# EasyEDA Pro project ProPrj_Arduino_Contest_2025_2025-11-19.epro, board Sensor_Module_Rev_0
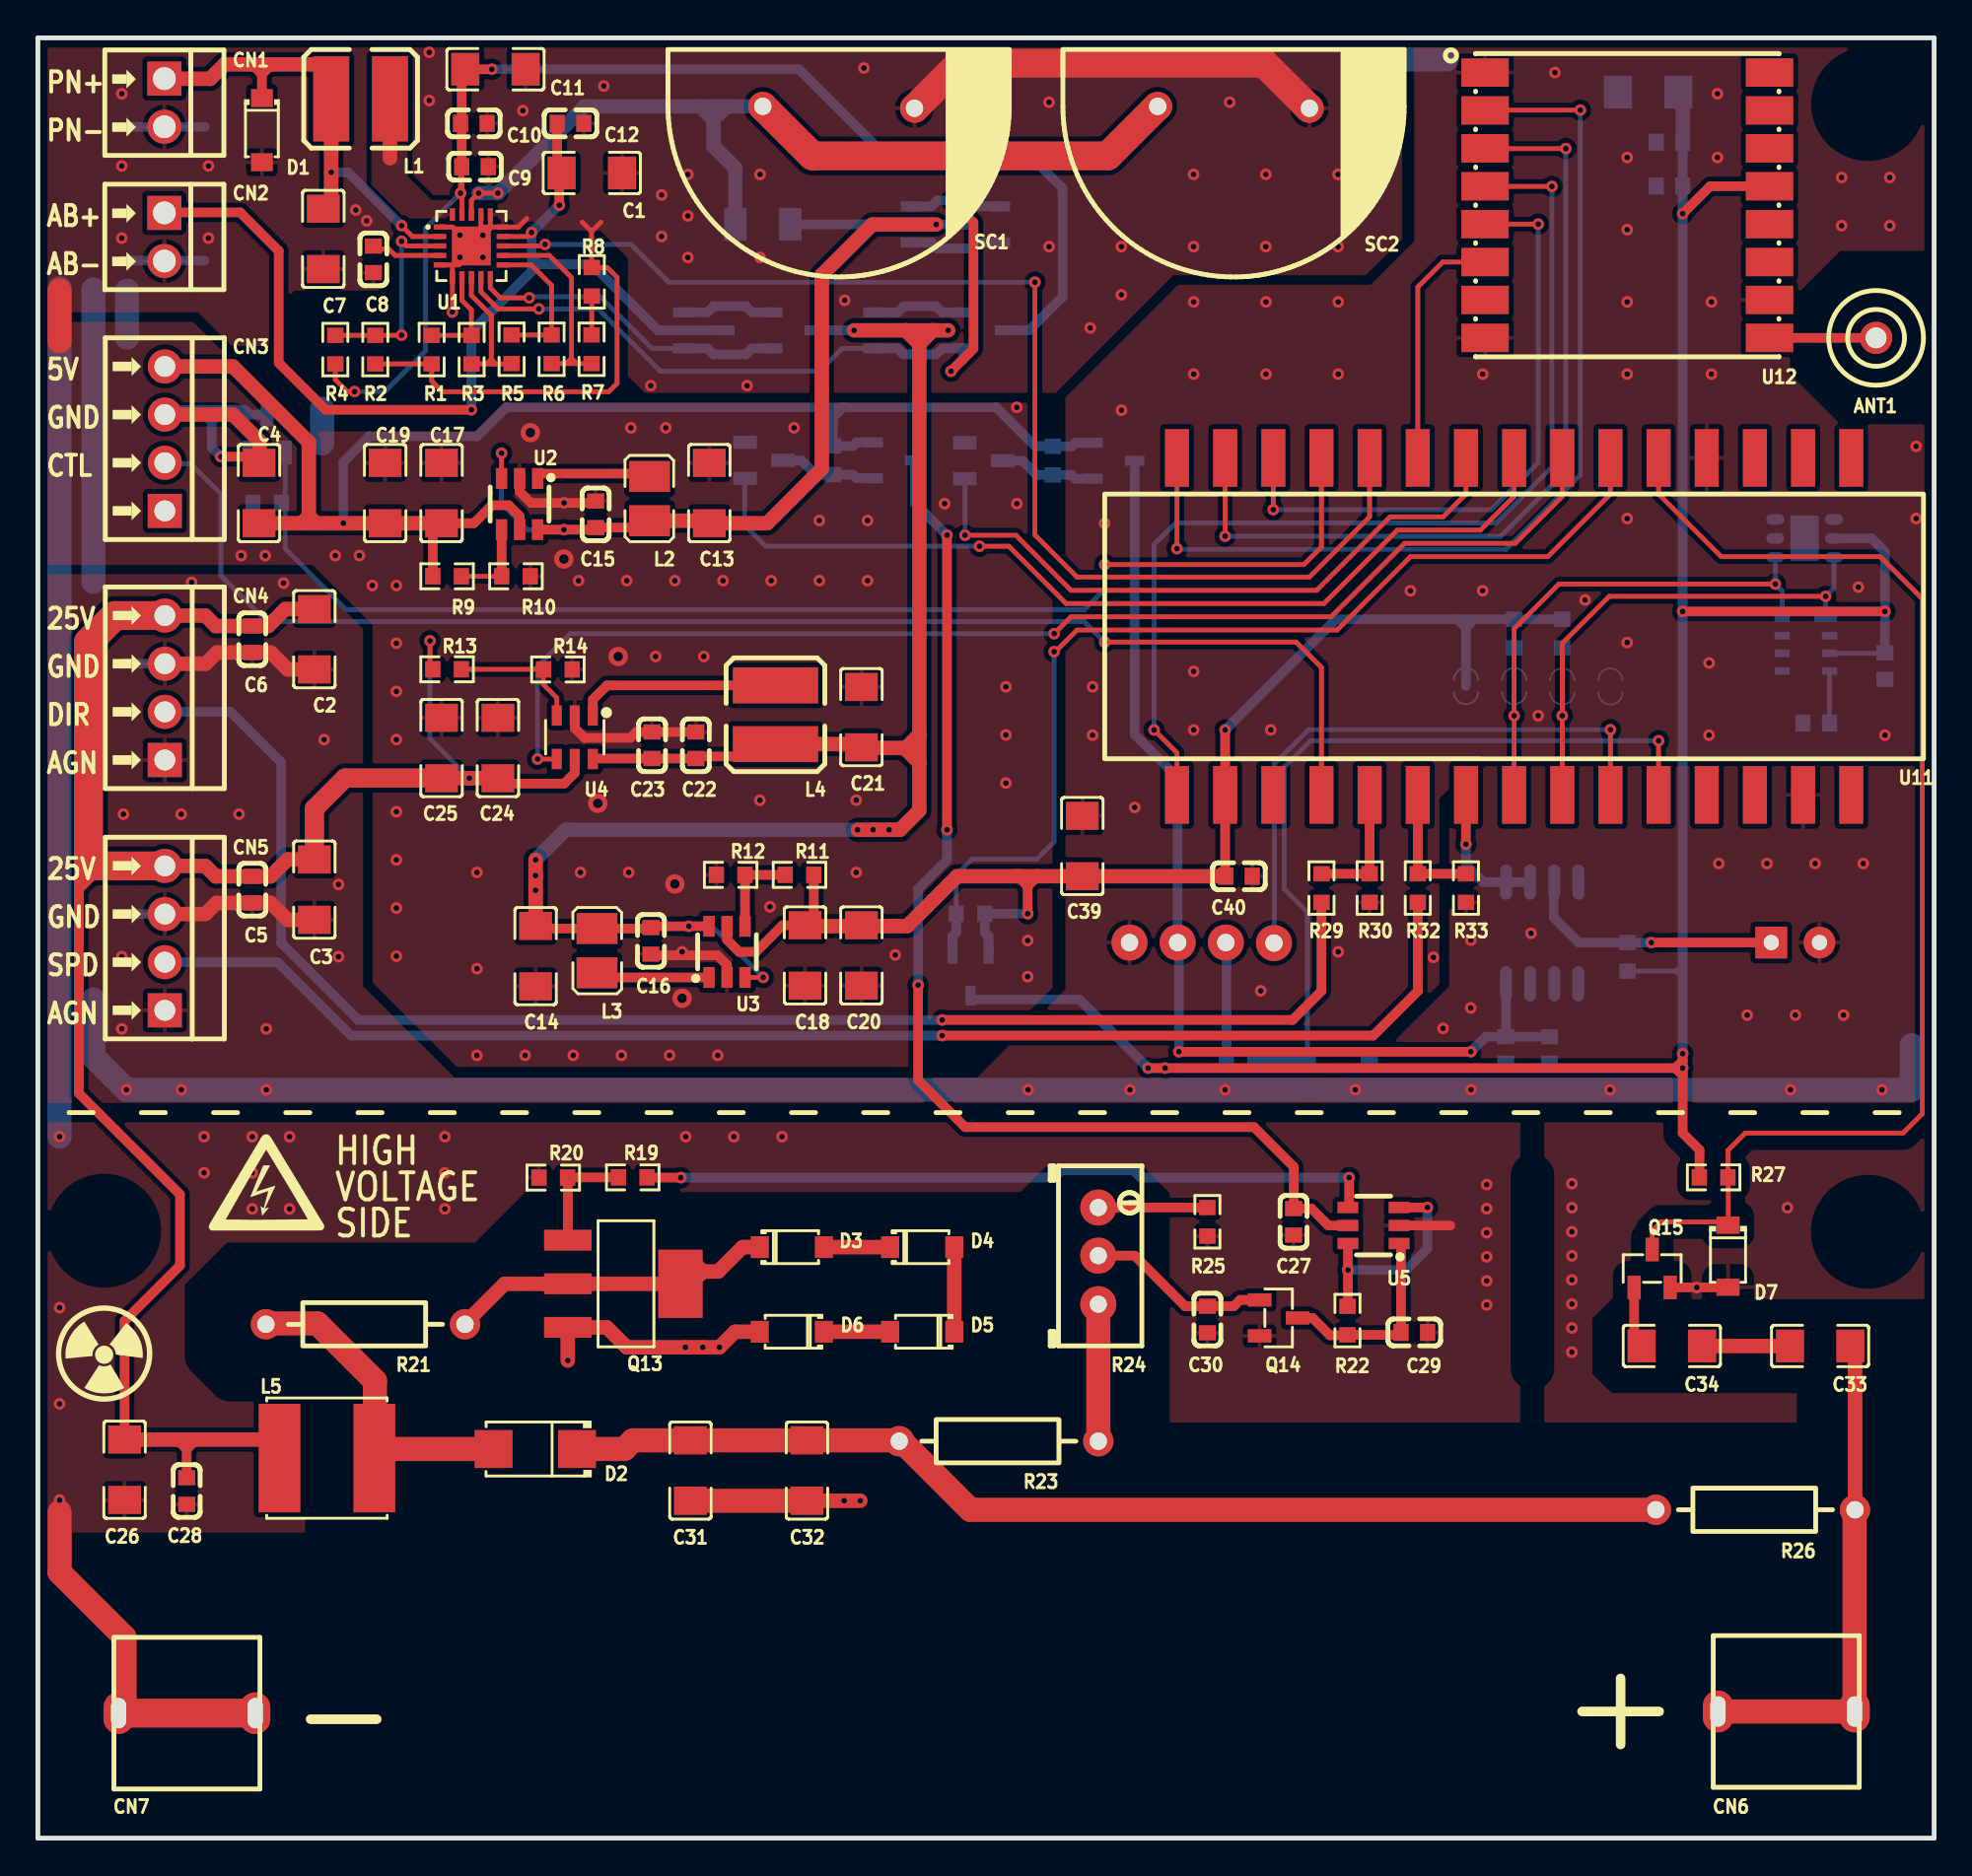
[diagram p23: board, top side]
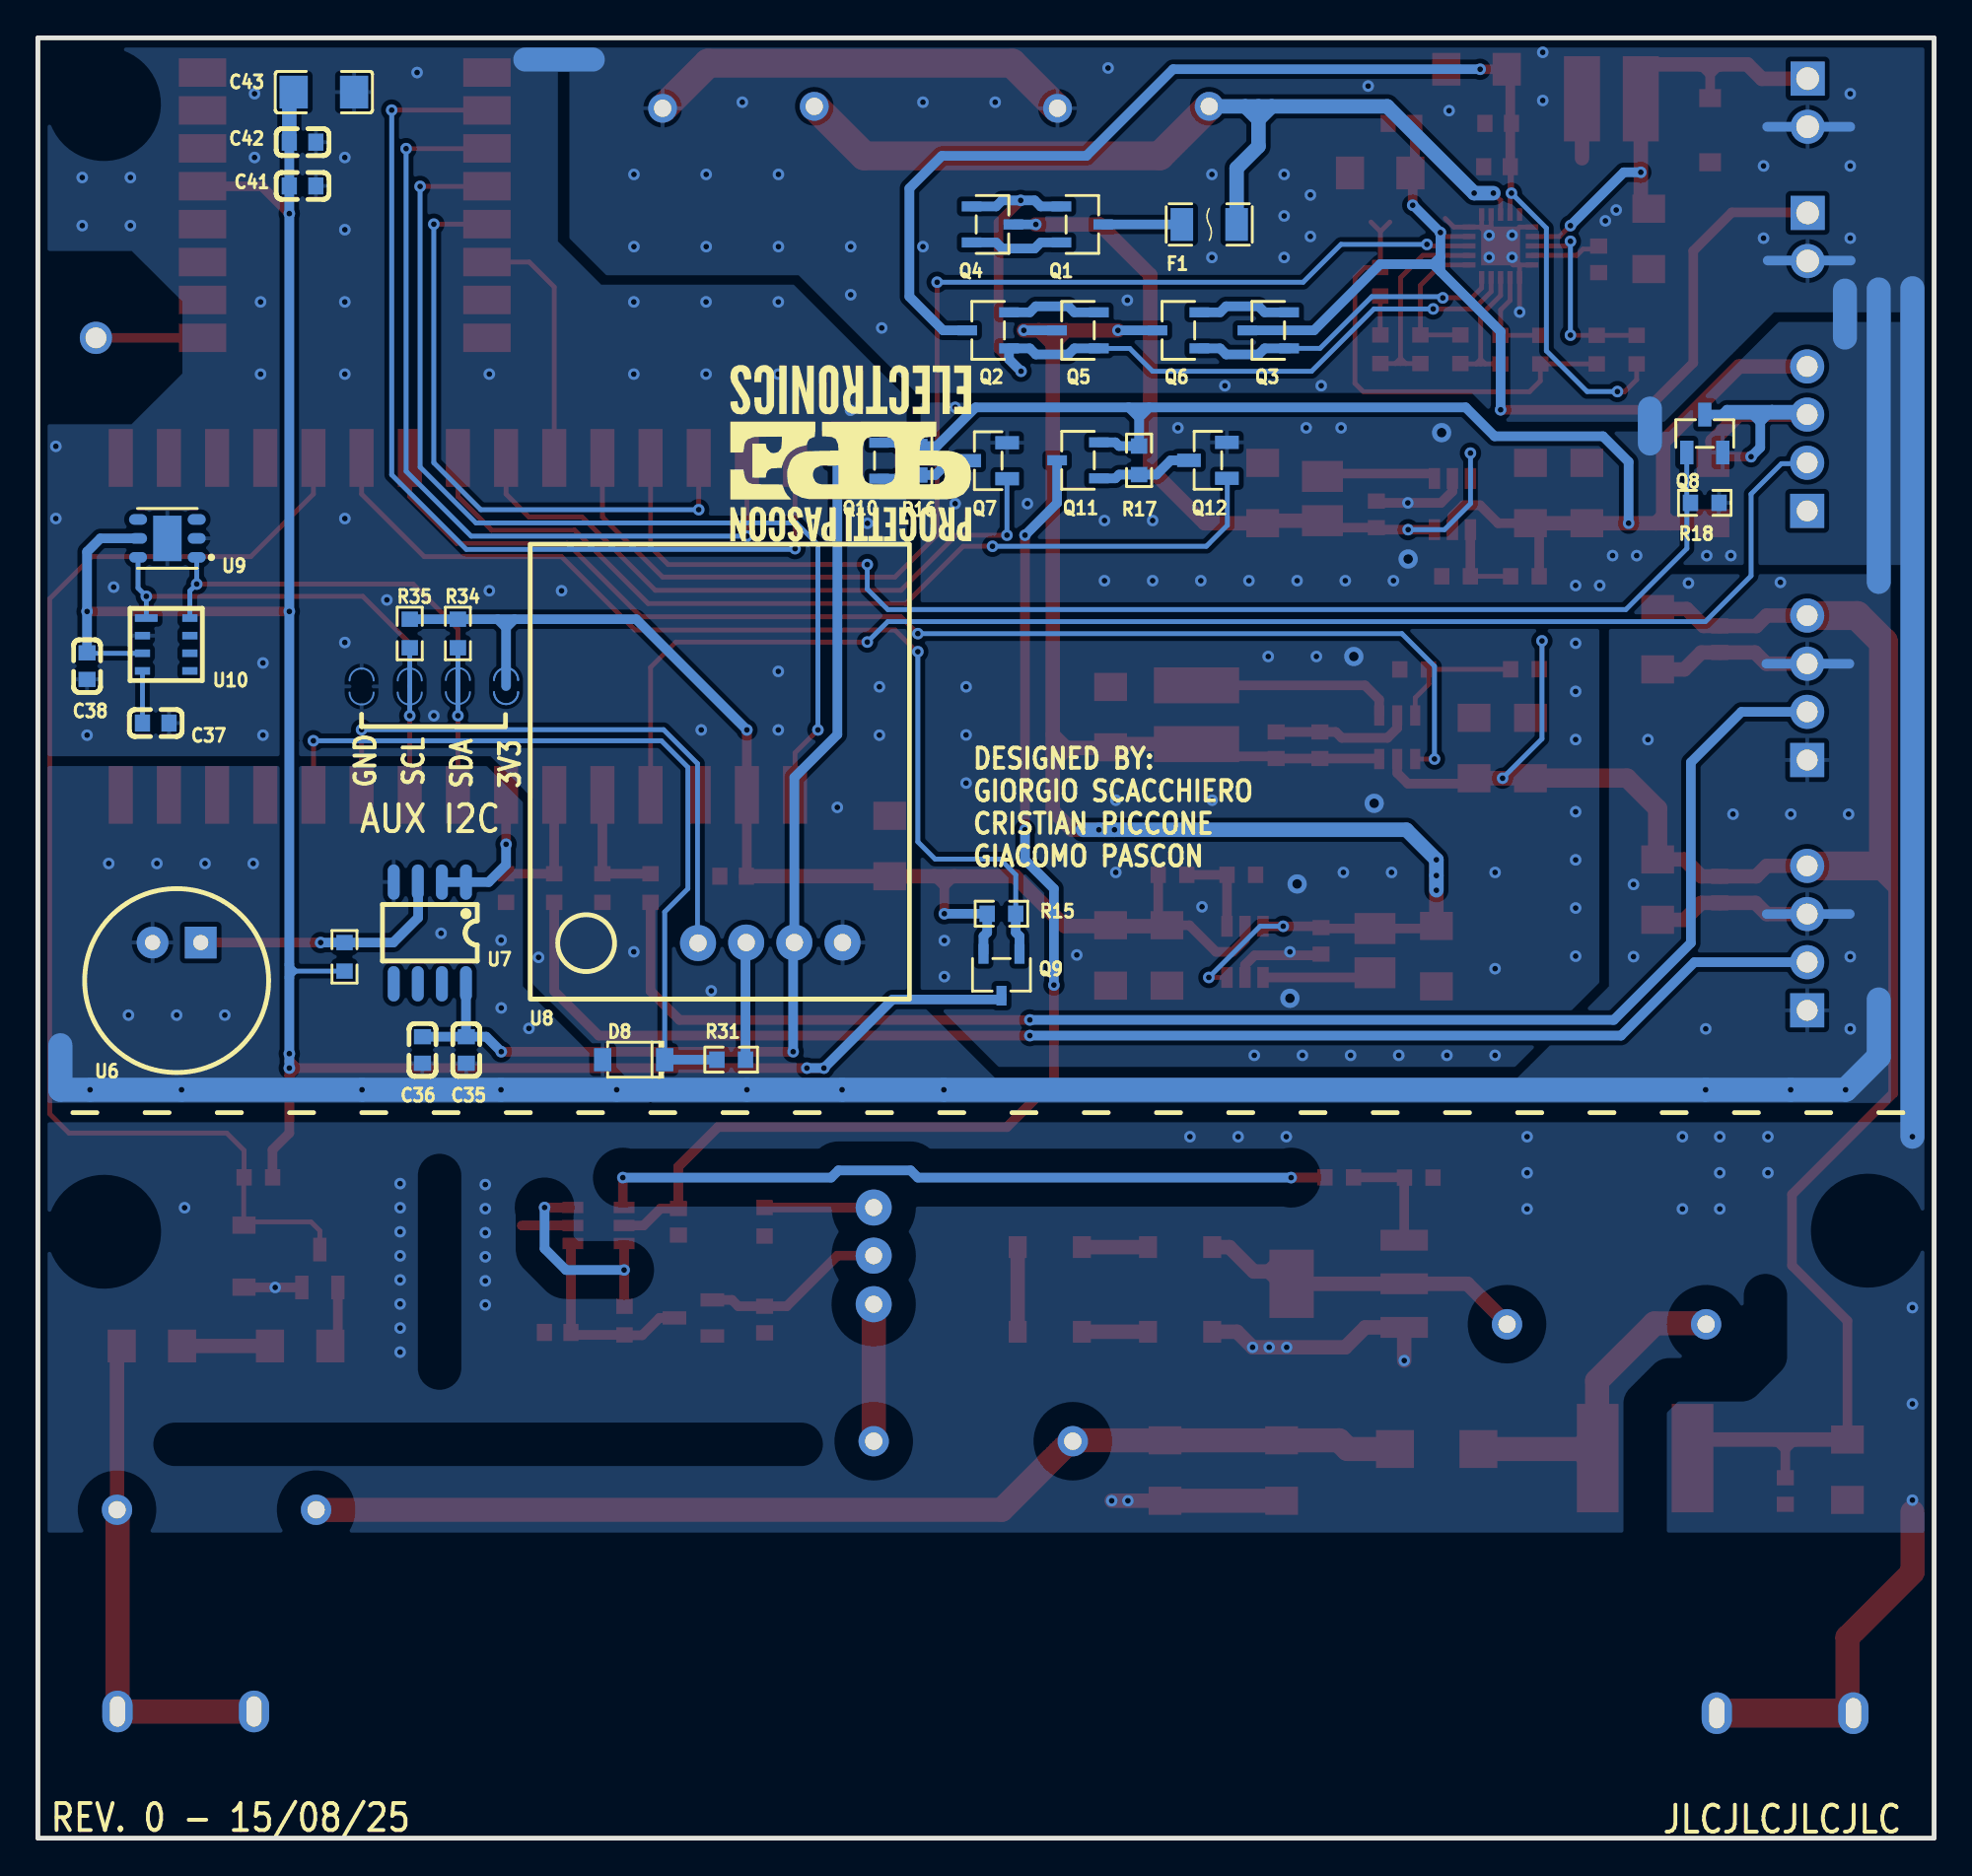
[diagram p24: board, bottom side, seen from below]

Outline 100 x 94.98 mm; copper layers: Top Layer, Bottom Layer. Coordinates in mm from the lower left corner of the outline.
Outline path: 0,94.98 100,94.98 100,0 0,0 0,94.98
Stack: Top Layer 0.035mm / Dielectric1 1.51mm FR4 er 4.5 / Bottom Layer 0.035mm

## Design rules (mm)
template: Custom Config
spacing copperThickness1oz (default): track to track 0.152, other pairs 0.152 to 0.3
spacing copperThickness2oz: track to track 0.203, other pairs 0.152 to 0.3
track width copperThickness1oz (default): min 0.127, default 0.254, max 2.54
track width copperThickness2oz: min 0.203, default 0.254, max 2.54
differential pair differentialPair (default): width min 0.127, default 0.254, max 2.54; gap min 0.152, default 0.152
via viaSize (default): diameter min 0.305, default 0.61, max 10.16; hole min 0.152, default 0.305, max 9.779
net $2N7577 uses traceRegion
pour e1770 uses Geiger_Logic_Copper
pour e2021 uses Geiger_Power_Copper

## Placement (name value [footprint] x y rotation side)
ANT1  VG868SNX18-5W2  [ANT-TH_VG868SNX18-5W2]  96.94 79.16 0 top
C1  4.7uF  [C1206]  29.21 87.86 180 top
C2  4.7uF  [C1206]  14.58 63.26 90 top
C3  4.7uF  [C1206]  14.58 50.04 90 top
C4  4.7uF  [C1206]  11.66 70.97 270 top
C5  100nF  [C0603]  11.3 50.04 90 top
C6  100nF  [C0603]  11.3 63.26 90 top
C7  4.7uF  [C1206]  15.05 84.38 90 top
C8  100pF  [C0603]  17.69 83.3 270 top
C9  100pF  [C0603]  23.05 88.19 180 top
C10  100nF  [C0603]  22.99 90.47 180 top
C11  4.7uF  [C1206]  24.13 93.33 180 top
C12  100pF  [C0603]  28.09 90.47 0 top
C13  4.7uF  [C1206]  35.41 70.97 270 top
C14  4.7uF  [C1206]  26.25 46.53 90 top
C15  100nF  [C0603]  29.41 69.85 270 top
C16  100nF  [C0603]  32.33 47.34 90 top
C17  4.7uF  [C1206]  21.29 70.97 270 top
C18  4.7uF  [C1206]  40.46 46.57 90 top
C19  4.7uF  [C1206]  18.31 70.97 270 top
C20  4.7uF  [C1206]  43.43 46.57 90 top
C21  4.7uF  [C1206]  43.43 59.14 270 top
C22  100nF  [C0603]  34.7 57.66 270 top
C23  100pF  [C0603]  32.39 57.66 270 top
C24  4.7uF  [C1206]  24.26 57.51 270 top
C25  4.7uF  [C1206]  21.29 57.51 270 top
C26  4.7uF  [C1206]  4.57 19.44 90 top
C27  100nF  [C0603]  66.22 32.52 90 top
C28  100nF  [C0603]  7.84 18.31 90 top
C29  10pF  [C0603]  72.59 26.68 180 top
C30  100pF  [C0603]  61.68 27.36 90 top
C31  1nF  [C1206]  34.41 19.39 90 top
C32  1nF  [C1206]  40.56 19.39 90 top
C33  10pF  [C1206]  93.99 25.97 0 top
C34  10pF  [C1206]  86.17 25.97 0 top
C35  100pF  [C0603]  77.41 41.58 90 bottom
C36  100nF  [C0603]  79.72 41.58 90 bottom
C37  100nF  [C0603]  93.79 58.83 0 bottom
C38  100nF  [C0603]  97.41 61.84 90 bottom
C39  4.7uF  [C1206]  55.08 52.34 90 top
C40  100nF  [C0603]  63.34 50.75 0 top
C41  100pF  [C0603]  86.04 87.17 0 bottom
C42  100nF  [C0603]  86.04 89.48 0 bottom
C43  4.7uF  [C1206]  84.92 92.12 0 bottom
CN1  DB125-2.54-2P-GN-S  [CONN-TH_DB125-2.54-2P-GN]  6.67 91.56 270 top
CN2  DB125-2.54-2P-GN-S  [CONN-TH_DB125-2.54-2P-GN]  6.67 84.48 270 top
CN3  DB125-2.54-4P-GN-S  [CONN-TH_DB125-2.54-4P-GN]  6.69 73.84 90 top
CN4  DB125-2.54-4P-GN-S  [CONN-TH_DB125-2.54-4P-GN]  6.69 60.69 90 top
CN5  DB125-2.54-4P-GN-S  [CONN-TH_DB125-2.54-4P-GN]  6.69 47.49 90 top
CN6  XF-007  [FUSE-TH_XF-007]  92.2 6.68 180 top
CN7  XF-007  [FUSE-TH_XF-007]  7.86 6.59 0 top
D1  1N4148W  [SOD-123_L2.8-W1.8-LS3.7-RD-1]  11.81 90.12 270 top
D2  RS1M  [SMA_L4.3-W2.6-LS5.2-RD]  26.23 20.53 180 top
D3  BZD27C200P  [SOD-123_L2.8-W1.8-LS3.7-RD]  39.76 31.18 0 top
D4  BZD27C200P  [SOD-123_L2.8-W1.8-LS3.7-RD]  46.64 31.18 0 top
D5  BZD27C200P  [SOD-123_L2.8-W1.8-LS3.7-RD]  46.64 26.72 180 top
D6  BZD27C200P  [SOD-123_L2.8-W1.8-LS3.7-RD]  39.76 26.72 180 top
D7  BZT52C3V3  [SOD-123_L2.7-W1.6-LS3.7-RD]  89.13 30.7 270 top
D8  BZT52C3V3  [SOD-123_L2.7-W1.6-LS3.7-RD]  68.58 41.07 0 bottom
F1  CFS12V3T2R50  [F1206]  38.23 85.14 0 bottom
L1  22uH  [IND-SMD_L4.5-W4.0]  17.02 91.77 0 top
L2  2.2uH  [L1008]  32.26 70.68 90 top
L3  2.2uH  [L1008]  29.49 46.82 270 top
L4  22uH  [IND-SMD_L4.5-W4.0]  38.9 59.27 270 top
L5  1mH  [IND-SMD_L6.0-W6.0]  15.24 20.05 0 top
NOREF  -  [Pad_e1683]  75.31 60.78 0 top
NOREF#2  -  [Pad_e1682]  82.93 60.76 0 top
NOREF#3  -  [Pad_e1611]  77.85 60.78 0 top
NOREF#4  -  [Pad_e1610]  80.39 60.76 0 top
NOREF#5  -  [Pad_e1821]  75.31 60.78 0 top
Q1  DO2301E-Q  [SOT-23-3_L3.0-W1.7-P0.95-LS2.9-BR]  44.92 85.14 0 bottom
Q2  DO2301E-Q  [SOT-23-3_L3.0-W1.7-P0.95-LS2.9-BR]  49.89 79.55 180 bottom
Q3  DO2301E-Q  [SOT-23-3_L3.0-W1.7-P0.95-LS2.9-BR]  35.11 79.55 180 bottom
Q4  DO2301E-Q  [SOT-23-3_L3.0-W1.7-P0.95-LS2.9-BR]  49.66 85.14 0 bottom
Q5  DO2301E-Q  [SOT-23-3_L3.0-W1.7-P0.95-LS2.9-BR]  45.15 79.55 180 bottom
Q6  DO2301E-Q  [SOT-23-3_L3.0-W1.7-P0.95-LS2.9-BR]  39.85 79.55 180 bottom
Q7  5N10-MS  [SOT-23-3_L2.9-W1.3-P1.90-LS2.4-BL-1]  49.88 72.67 90 bottom
Q8  5N10-MS  [SOT-23-3_L2.9-W1.3-P1.90-LS2.4-BL-1]  12.09 74.11 180 bottom
Q9  DO2301E-Q  [SOT-23-3_L3.0-W1.7-P0.95-LS2.9-BR]  49.18 45.55 90 bottom
Q10  DO2301E-Q  [SOT-23-3_L3.0-W1.7-P0.95-LS2.9-BR]  56.74 72.67 180 bottom
Q11  DO2301E-Q  [SOT-23-3_L3.0-W1.7-P0.95-LS2.9-BR]  45.15 72.69 180 bottom
Q12  5N10-MS  [SOT-23-3_L2.9-W1.3-P1.90-LS2.4-BL-1]  38.29 72.69 90 bottom
Q13  SP05N100TC  [SOT-223-3_L6.5-W3.4-P2.30-LS7.0-BR-1]  30.91 29.25 180 top
Q14  5N10-MS  [SOT-23-3_L2.9-W1.3-P1.90-LS2.4-BL-1]  65.43 27.45 270 top
Q15  S8050-J3Y  [SOT-23-3_L2.9-W1.3-P0.95-LS2.4-BR-1]  85.13 30.05 270 top
R1  7.87MΩ  [R0603]  20.76 78.54 270 top
R2  0Ω  [R0603]  17.79 78.54 90 top
R3  4.12MΩ  [R0603]  22.87 78.54 90 top
R4  0Ω  [R0603]  15.68 78.54 270 top
R5  1.5MΩ  [R0603]  24.98 78.56 270 top
R6  3.9MΩ  [R0603]  27.09 78.56 90 top
R7  3.32MΩ  [R0603]  29.2 78.56 90 top
R8  3.32MΩ  [R0603]  29.21 82.11 90 top
R9  887kΩ  [R0603]  21.58 66.58 180 top
R10  100kΩ  [R0603]  25.21 66.58 180 top
R11  453kΩ  [R0603]  40.16 50.82 0 top
R12  82kΩ  [R0603]  36.53 50.82 0 top
R13  2.32MΩ  [R0603]  21.58 61.67 180 top
R14  75kΩ  [R0603]  27.42 61.66 180 top
R15  1MΩ  [R0603]  49.18 48.77 180 bottom
R16  1MΩ  [R0603]  53.52 72.67 270 bottom
R17  1MΩ  [R0603]  41.93 72.69 270 bottom
R18  1MΩ  [R0603]  12.09 70.45 180 bottom
R19  0Ω  [R0603]  31.37 34.86 0 top
R20  1MΩ  [R0603]  27.18 34.85 180 top
R21  100Ω  [RES-TH_BD2.2-L6.5-P10.50-D0.6]  17.27 27.11 180 top
R22  1MΩ  [R0603]  69.06 27.3 90 top
R23  10MΩ  [RES-TH_BD2.2-L6.5-P10.50-D0.6]  50.67 20.94 180 top
R24  100kΩ  [RES-ADJ-TH_3P-L9.5-W4.9-P2.50-L_3296W]  55.92 30.72 270 top
R25  0Ω  [R0603]  61.68 32.52 90 top
R26  10MΩ  [RES-TH_BD2.2-L6.5-P10.50-D0.6]  90.58 17.32 180 top
R27  100kΩ  [R0603]  88.37 34.86 180 top
R28  2.2kΩ  [R0603]  83.83 46.5 270 bottom
R29  17.4kΩ  [R0603]  67.69 50.13 270 top
R30  33kΩ  [R0603]  70.23 50.13 90 top
R31  330Ω  [R0603]  63.44 41.07 180 bottom
R32  17.4kΩ  [R0603]  72.77 50.13 270 top
R33  33kΩ  [R0603]  75.31 50.13 90 top
R34  100kΩ  [R0603]  77.85 63.56 90 bottom
R35  100kΩ  [R0603]  80.39 63.56 90 bottom
SC1  -  [BIGCAP_BUP002R8L107FA]  42.23 91.37 0 top
SC2  -  [BIGCAP_BUP002R8L107FA]  63.06 91.37 0 top
U1  BQ25505RGRR  [VQFN-20_L3.5-W3.5-P0.50-TL-EP]  22.86 84 0 top
U2  TLV61070ADBVR  [SOT-23-6_L2.9-W1.6-P0.95-LS2.8-BR]  25.4 70.39 90 top
U3  TLV61070ADBVR  [SOT-23-6_L2.9-W1.6-P0.95-LS2.8-BR]  36.34 46.76 270 top
U4  TLV61046ADBVR  [SOT-23-6_L2.9-W1.6-P0.95-LS2.8-BL]  28.31 58.08 180 top
U5  SN74LVC2G04DBVR(UMW)  [SOT-23-6_L2.9-W1.6-P0.95-LS2.8-BR]  70.44 32.32 0 top
U6  GMI9745P-48DB  [MIC-TH_BD9.7-P2.54-D0.8-L-FD]  92.68 47.25 0 bottom
U7  BA4558F-E2  [SOP-8_L4.9-W3.9-P1.27-LS6.0-BL]  79.33 47.76 0 bottom
U8  -  [Saiya_SYP16]  54.04 44.27 90 bottom
U9  HDC1080DMBR  [SENSOR-SMD_HDC1080DMBR]  93.17 68.58 0 bottom
U10  WF183DE 15BA L8B T&R  [LGA-8_L3.8-W3.8-P0.93-BL]  93.24 62.98 180 bottom
U11  -  [Arduino_NANO_ESP32]  59.44 56.31 90 top
U12  868MHz  [COMM-SMD_LORA1276-C1-915MHZ]  83.82 86.16 0 top

## Footprints (pads in the part's own frame, mm; a bottom-side part is the same pattern mirrored in y, then rotated)
ANT-TH_VG868SNX18-5W2
  round 1.7 hole 1.1: 1(0,0)
Arduino_NANO_ESP32
  rect 3.048x1.27 smd: 1(-1.27,-0.635) 2(-1.27,-3.175) 3(-1.27,-5.715) 4(-1.27,-8.255) 5(-1.27,-10.795) 6(-1.27,-13.335) 7(-1.27,-15.875) 8(-1.27,-18.415) 9(-1.27,-20.955) 10(-1.27,-23.495) 11(-1.27,-26.035) 12(-1.27,-28.575) 13(-1.27,-31.115) 14(-1.27,-33.655) 15(-1.27,-36.195) 16(16.51,-0.635) 17(16.51,-3.175) 18(16.51,-5.715) 19(16.51,-8.255) 20(16.51,-10.795) 21(16.51,-13.335) 22(16.51,-15.875) 23(16.51,-18.415) 24(16.51,-20.955) 25(16.51,-23.495) 26(16.51,-26.035) 27(16.51,-28.575) 28(16.51,-31.115) 29(16.51,-33.655) 30(16.51,-36.195)
BIGCAP_BUP002R8L107FA
  round 1.524 hole 0.914: 1(-4,0) 2(4,-0.1)
C0603
  rect 0.8x0.9 smd: 1(-0.7,0) 2(0.7,0)
C1206
  rect 1.485x1.728 smd: 1(-1.593,0) 2(1.593,0)
COMM-SMD_LORA1276-C1-915MHZ
  rect 2.5x1.5 smd: 1(-7.5,7) 2(-7.5,5) 3(-7.5,3) 4(-7.5,1) 5(-7.5,-1) 6(-7.5,-3) 7(-7.5,-5) 8(-7.5,-7) 9(7.5,-7) 10(7.5,-5) 11(7.5,-3) 12(7.5,-1) 13(7.5,1) 14(7.5,3) 15(7.5,5) 16(7.5,7)
CONN-TH_DB125-2.54-2P-GN
  rect 1.8x1.8 hole 1.2: 1(-1.27,0)
  round 1.8 hole 1.2: 2(1.27,0)
CONN-TH_DB125-2.54-4P-GN
  rect 1.8x1.8 hole 1.1: 1(-3.81,0)
  round 1.8 hole 1.1: 2(-1.27,0) 3(1.27,0) 4(3.81,0)
F1206
  rect 1.19x1.728 smd: 1(-1.445,0) 2(1.445,0)
FUSE-TH_XF-007
  oval 1.6x2.2 hole 0.8x1.6: 1(-3.6,0) 1(3.6,0)
IND-SMD_L4.5-W4.0
  rect 1.9x4.5 smd: 1(-1.55,0) 2(1.55,0)
IND-SMD_L6.0-W6.0
  rect 2.2x5.72 smd: 1(-2.5,0) 2(2.5,0)
L1008
  rect 1.635x2.16 smd: 1(-1.167,0) 2(1.167,0)
LGA-8_L3.8-W3.8-P0.93-BL
  rect 1.2x0.4 smd: 1(-1.05,1.395)
  rect 0.8x0.4 smd: 2(-1.25,0.465) 3(-1.25,-0.465) 4(-1.25,-1.395) 5(1.25,-1.395) 6(1.25,-0.465) 7(1.25,0.465) 8(1.25,1.395)
MIC-TH_BD9.7-P2.54-D0.8-L-FD
  rect 1.677x1.677 hole 0.8: 1(-1.27,0)
  round 1.677 hole 0.8: 2(1.27,0)
Pad_e1610
  custom 1.27x1.905 smd far side: 31(0,0)
Pad_e1611
  custom 1.27x1.905 smd far side: 32(0,0)
Pad_e1682
  custom 1.27x1.905 smd far side: 31(0,0)
Pad_e1683
  custom 1.27x1.905 smd far side: 31(0,0)
Pad_e1821
  custom 1.27x1.905 smd far side: 31(0,0)
R0603
  rect 0.806x0.864 smd: 1(-0.753,0) 2(0.753,0)
RES-ADJ-TH_3P-L9.5-W4.9-P2.50-L_3296W
  round 1.9 hole 0.9: 1(-2.55,0) 2(-0.01,0) 3(2.55,0)
RES-TH_BD2.2-L6.5-P10.50-D0.6
  round 1.6 hole 0.914: 1(-5.25,0) 2(5.25,0)
Saiya_SYP16
  round 1.9 hole 0.914x0.9: 1(2.955,11.15) 2(2.981,8.611) 3(2.981,6.071) 4(2.981,3.53)
SENSOR-SMD_HDC1080DMBR
  oval 0.95x0.56 smd: 1(-1.548,1) 2(-1.548,0) 3(-1.548,-1) 4(1.548,-1) 5(1.548,0) 6(1.548,1)
  rect 1.5x2.4 smd: 7(0,0)
SMA_L4.3-W2.6-LS5.2-RD
  rect 2x2 smd: 1(-2.2,0) 2(2.2,0)
SOD-123_L2.7-W1.6-LS3.7-RD
  rect 0.91x1.22 smd: 1(-1.635,0) 2(1.635,0)
SOD-123_L2.8-W1.8-LS3.7-RD
  rect 0.95x1.15 smd: 1(-1.692,0) 2(1.692,0)
SOD-123_L2.8-W1.8-LS3.7-RD-1
  rect 0.95x1.15 smd: 1(-1.692,0) 2(1.692,0)
SOP-8_L4.9-W3.9-P1.27-LS6.0-BL
  oval 0.63x1.865 smd: 1(-1.905,-2.683) 2(-0.635,-2.683) 3(0.635,-2.683) 4(1.905,-2.683) 5(1.905,2.683) 6(0.635,2.683) 7(-0.635,2.683) 8(-1.905,2.683)
SOT-23-3_L2.9-W1.3-P0.95-LS2.4-BR-1
  rect 1.25x0.7 smd: 1(1,-0.95) 2(1,0.95) 3(-1,0)
SOT-23-3_L2.9-W1.3-P1.90-LS2.4-BL-1
  rect 0.7x1.25 smd: 1(-0.95,-1) 2(0.95,-1) 3(0,1)
SOT-23-3_L3.0-W1.7-P0.95-LS2.9-BR
  rect 1.038x0.532 smd: 1(1.101,-0.95) 2(1.101,0.95) 3(-1.101,0)
SOT-23-6_L2.9-W1.6-P0.95-LS2.8-BL
  rect 0.532x1.072 smd: 1(-0.95,-1.149) 2(0,-1.149) 3(0.95,-1.149) 4(0.95,1.149) 5(0,1.149) 6(-0.95,1.149)
SOT-23-6_L2.9-W1.6-P0.95-LS2.8-BR
  rect 1.1x0.6 smd: 1(1.35,-0.95) 2(1.35,0) 3(1.35,0.95) 4(-1.35,0.95) 5(-1.35,0) 6(-1.35,-0.95)
SOT-223-3_L6.5-W3.4-P2.30-LS7.0-BR-1
  rect 2.5x1.1 smd: 1(2.97,-2.3) 2(2.97,0) 3(2.97,2.3)
  rect 2.34x3.6 smd: 2(-2.97,0)
VQFN-20_L3.5-W3.5-P0.50-TL-EP
  rect 0.665x0.28 smd: 1(-1.657,1) 2(-1.657,0.5) 3(-1.657,0) 4(-1.657,-0.5) 5(-1.657,-1) 11(1.657,-1) 12(1.657,-0.5) 13(1.657,0) 14(1.657,0.5) 15(1.657,1)
  rect 0.28x0.665 smd: 6(-1,-1.657) 7(-0.5,-1.657) 8(0,-1.657) 9(0.5,-1.657) 10(1,-1.657) 16(1,1.657) 17(0.5,1.657) 18(0,1.657) 19(-0.5,1.657) 20(-1,1.657)
  rect 2.05x2.05 smd: 21(0,0)

## Nets
As in the schematic, except:
+3V3: C18.2 C20.2 C39.1 C40.1 NOREF.31 NOREF#5.31 Q9.2 R11.2 R15.1 R34.2 R35.2 U3.5 U11.2
GND: C1.1 C2.1 C3.1 C5.1 C6.1 C7.1 C8.2 C9.1 C10.1 C11.1 C12.2 C13.1 C14.1 C15.1 C16.1 C17.1 C18.1 C19.1 C20.1 C21.1 C22.1 C23.1 C24.1 C25.1 C26.1 C27.1 C28.1 C29.1 C30.1 C31.1 C32.1 C35.1 C36.1 C37.1 C38.1 C39.2 C40.2 C41.1 C42.1 C43.1 CN1.2 CN2.2 CN4.1 CN4.3 CN5.1 CN5.3 CN7.1 D1.2 D6.2 D7.2 D8.2 NOREF#2.31 Q7.2 Q8.2 Q12.2 Q13.3 Q14.2 Q15.2 R1.2 R2.1 R8.2 R10.1 R12.1 R14.1 R18.2 R20.2 R25.1 R30.1 R33.1 SC1.2 SC2.2 U1.1 U1.5 U1.6 U1.15 U1.16 U1.17 U1.21 U2.2 U3.2 U4.2 U5.2 U6.2 U7.4 U8.4 U9.2 U9.7 U10.2 U11.14 U11.27 U12.1 U12.8 U12.10
I2C_SCL: NOREF#4.31 R35.1 U9.6 U10.1 U11.9
I2C_SDA: NOREF#3.32 R34.1 U9.1 U10.8 U11.8

Pads without a net: CN3 1; U7 5 6 7; U9 3 4; U10 5 6 7; U11 3 12 13 15 28 29 30; U12 7 11 12 14 15 16

## Via types
v1: diameter 0.61, hole 0.305, Top Layer to Bottom Layer, 285 vias
v2: diameter 1.016, hole 0.508, Top Layer to Bottom Layer, 6 vias

## Routing (per net, layer and track width the routed paths; a pad name or vN(x,y) marks a point on that pad's centre or on a via; arc(x,y) is an arc through that point)
3V3_SW_EN: length 54.9
  Top Layer w0.254: U11.25 82.93,70.92 79.63,67.61 72.39,67.61 68.52,63.74 54.8,63.74 53.66,62.6 v1(53.59,62.6)
  Bottom Layer w0.254: R15.2 48.43,50.83 49.26,51.66 52.68,51.66 53.59,52.57 v1(53.59,62.6)
  Bottom Layer w0.508: Q9.1 48.23,46.65 48.23,47.58 48.43,47.78 R15.2
5V_GEIG_EN: length 49.1
  Top Layer w0.254: U11.23 77.85,70.79 76.07,69.01 71.69,69.01 67.82,65.14 54.23,65.14 51.21,68.16 v1(49.66,68.16)
  Bottom Layer w0.254: v1(49.66,68.16) 38.38,68.16 37.27,69.27 37.27,71.72 Q12.1
5V_SENS_EN: length 34.6
  Top Layer w0.254: U11.22 75.31,70.92 74.1,69.71 71.31,69.71 67.44,65.84 54.48,65.84 51.58,68.74 v1(48.9,68.74)
  Bottom Layer w0.254: v1(48.9,68.74) 48.9,71.73 48.88,71.74
25V_EN: length 65.7
  Top Layer w0.254: 27.36,56.94 v1(26.35,56.94) ; U11.24 80.39,70.79 77.91,68.31 72.07,68.31 68.2,64.44 54.48,64.44 v1(53.59,63.55)
  Bottom Layer w0.254: v1(53.59,63.55) 28.07,63.55 26.35,61.83 v1(26.35,56.94)
+3V3: length 71.4
  Top Layer w0.508: v1(52.2,48.77) 52.2,50.22 ; 52.2,50.22 51.67,50.75 ; 52.2,50.22 52.73,50.75 ; U3.5 36.34,47.4 36.98,46.76 37.87,46.76 39.27,48.16 C18.2 40.92,48.62 R11.2 ; v1(62.61,58.47) U11.2 62.61,50.84
  Top Layer w0.762: C18.2 40.5,48.12 43.38,48.12 C20.2 43.47,48.12 45.85,48.12 48.48,50.75 C39.1 C40.1
  Bottom Layer w0.508: R35.2 R34.2 75.75,64.31 ; v1(52.2,48.77) R15.1 49.94,47.78 50.13,47.58 Q9.2 ; NOREF.31 75.31,63.87 ; 75.31,63.87 74.87,64.31 ; 75.31,63.87 75.75,64.31 ; 74.87,64.31 68.45,64.31 v1(62.61,58.47) ; 74.87,64.31 75.75,64.31
+3V3SW: length 130.3
  Top Layer w0.508: v1(97.41,64.72) v1(86.74,64.72) ; U12.13 88.19,87.16 v1(86.74,85.71) ; v1(86.74,40.63) 86.36,40.63 ; v1(86.74,40.63) 86.74,40.24 ; v1(86.74,40.63) 86.74,41.01 ; 86.36,40.63 86.74,40.24 ; 86.36,40.63 86.74,41.01 ; 86.36,40.63 v1(59.45,40.63) v1(58.55,40.63) ; 86.74,40.24 86.74,37.2 87.63,36.31 87.63,34.87 87.62,34.86 ; 86.74,41.01 v1(86.74,41.39)
  Bottom Layer w0.254: 86.4,45.74 86.74,45.4 ; 86.4,45.74 86.74,46.09 ; 86.4,45.74 R28.2 ; 94.56,62.51 97.44,62.51 97.45,62.53
  Bottom Layer w0.508: C42.2 C41.2 v1(86.74,85.71) ; Q9.3 49.18,44.25 54.93,44.25 v1(58.55,40.63) v1(59.45,40.63) ; C38.2 v1(97.41,64.72) 97.41,67.87 96.7,68.58 U9.5 ; v1(86.74,40.63) v1(86.74,41.39) v1(86.74,64.72) 86.74,85.71
  Bottom Layer w0.762: C42.2 86.74,91.89 C43.2
+5V: length 82.4
  Top Layer w0.508: U2.5 25.4,69.75 24.83,70.32 23.94,70.32 22.99,69.38 C17.2 20.83,68.91 20.83,66.58
  Top Layer w0.762: CN3.4 10.29,77.65 14.29,73.65 14.29,69.76 ; 14.29,69.76 13.91,69.38 ; 14.29,69.76 14.67,69.38 ; 13.91,69.38 C4.2 ; 13.91,69.38 14.67,69.38 ; C17.2 C19.2 v1(16.11,69.38) 14.67,69.38
  Bottom Layer w0.508: 41.39,75.49 24.7,75.49 23.18,73.96 17.46,73.96 16.11,72.61 v1(16.11,69.38) ; 41.39,75.49 41.93,74.95 ; 41.39,75.49 42.47,75.49 ; R16.1 54.53,73.43 54.73,73.62 Q10.2 ; 42.47,75.49 50.55,75.49 52.59,73.45 53.52,73.45 ; 42.47,75.49 41.93,74.95 ; 41.93,74.95 R17.1 42.98,73.45 43.18,73.64 Q11.2
+5V_GEIG: length 61.2
  Top Layer w0.508: v1(46.42,45.01) 46.42,39.99 48.9,37.52 64.13,37.52 66.23,35.42 66.23,33.23 C27.2 67.16,33.22 68.06,32.32 U5.5 ; v1(47.94,68.74) v1(47.94,53.2)
  Bottom Layer w0.508: v1(47.94,53.2) 47.94,51.61 46.42,50.09 v1(46.42,45.01) ; Q11.3 46.25,70.44 v1(47.94,68.74)
+5V_SENS: length 54.8
  Top Layer w0.508: v1(60.17,41.49) v1(75.56,41.49)
  Bottom Layer w0.508: C35.2 77.43,42.3 U7.8 ; C35.2 76.36,42.28 v1(75.56,41.49) ; C35.2 C36.2 ; 57.84,72.69 57.84,58.23 60.11,55.96 U8.3 60.17,47.19 v1(60.17,41.49)
+25V: length 114
  Top Layer w0.254: 20.83,61.67 20.68,61.82 v1(20.68,63.17)
  Top Layer w0.508: 2.16,50.07 2.16,53.07 ; 2.16,50.07 2.94,50.85 ; 2.16,50.07 2.16,39.29 7.49,33.96 7.49,30.21 4.57,27.29 4.57,21.03 ; 7.84,20.51 7.33,21.03 ; 7.84,20.51 8.36,21.03 ; 7.84,20.51 C28.2 ; C24.2 24.54,55.64 27.75,55.64 28.31,56.2 U4.5
  Top Layer w0.762: CN4.4 8.83,64.5 9.38,63.95 11.3,63.95 ; C2.2 13.05,64.85 12.15,63.96 C6.2 ; CN5.4 8.83,51.3 9.38,50.74 12.28,50.74 13.17,51.64 C3.2 ; C24.2 v1(22.76,55.92) C25.2 ; 4.57,21.03 12.22,21.03 12.22,19.45
  Top Layer w1.016: C3.2 14.58,54.32 16.19,55.93 21.28,55.93 C25.2
  Top Layer w1.524: CN5.4 2.67,51.3 2.67,63.11 4.06,64.5 CN4.4
  Bottom Layer w0.254: v1(20.68,63.17) 20.68,58 v1(22.76,55.92)
GND: length 332.6
  Top Layer w0.254: 21.86,83 22.2,83 22.86,83.66 U1.21 ; 21.86,83 U1.5 ; 21.86,83 U1.6 21.86,80.52 v1(21.86,80.52) ; 21.86,83 U1.21 ; U1.1 21.86,85 U1.21 ; U1.17 23.36,85.03 23.39,85 ; 23.39,85 23.5,84.9 23.5,84.56 ; 23.39,85 23.86,85 ; R2.1 R1.2 20.76,76.89 21.34,76.31 30.1,76.31 30.54,76.76 30.54,82.35 30.02,82.87 R8.2 29.2,82.88 29.2,84.77 ; 29.2,84.77 29.7,85.27 ; 29.2,84.77 28.7,85.27 ; 25.78,85.46 25.33,85 U1.15 23.86,85 ; U1.21 22.94,84 23.5,84.56 ; 23.86,85 23.86,84.93 23.5,84.56 ; 23.86,85 U1.16
  Top Layer w0.508: C22.1 C23.1 31.55,58.36 31.24,58.05 28.82,58.05 28.31,58.56 U4.2 ; U3.2 36.34,46.07 35.83,46.58 32.33,46.58 ; 74.49,32.32 U5.2 ; Q15.2 v1(87.49,29.05) 89.12,29.05 D7.2 ; U2.2 25.4,71.05 26,70.45 v1(27.75,70.45) 29.32,70.45 C15.1
  Top Layer w0.762: C2.1 13.17,61.66 12.28,62.56 C6.1 9.44,62.56 8.85,61.96 6.71,61.96 ; C32.1 v1(42.52,17.8) v1(43.37,17.8) ; CN5.3 8.83,48.76 9.42,49.34 C5.1 12.28,49.34 13.17,48.45 C3.1 ; 38.07,26.72 36.76,26.72 v1(35.94,25.9) v1(35.07,25.9) v1(34.14,25.9) 31.05,25.9 30,26.95 Q13.3 v1(27.94,25.2)
  Top Layer w1.27: CN7.1 4.57,6.9 4.57,10.59 1.14,14.02 1.14,17.2 ; 1.14,81.65 1.14,78.98 ; C31.1 C32.1
  Top Layer w1.524: CN7.1 CN7.1 ; 46.24,91.27 48.62,93.65 64.66,93.65 67.04,91.27
  Bottom Layer w0.508: 8.83,48.76 CN5.3 4.44,48.76 ; 4.46,61.96 CN4.3 8.85,61.96 ; 8.78,83.24 4.39,83.24 ; 4.42,90.29 CN1.2 8.8,90.29
  Bottom Layer w1.27: 2.92,44.25 2.92,41.23 v1(4.67,39.48) v1(7.56,39.48) v1(12.05,39.48) v1(52.22,39.48) v1(57.59,39.48) v1(62.61,39.48) v1(69.48,39.48) v1(75.58,39.48) v1(82.91,39.48) v1(92.43,39.48) v1(97.25,39.48) 98.82,39.48 98.82,41.83 ; v1(1.14,37.01) 1.14,81.78 ; 6.64,83.24 CN2.2 ; 70.74,93.84 74.29,93.84 ; 4.7,79.17 4.7,81.65 ; 14.99,73.58 14.99,75.43 ; 2.92,81.71 2.92,66.28
  vias: v1(1.14,27.99) v1(1.14,22.91) v1(1.14,17.83) v1(4.42,92.04) v1(4.42,88.23) v1(4.42,84.42) v1(4.42,46.51) v1(4.42,42.7) v1(4.51,54.03) v1(7.56,54.03) v1(8.11,66.26) v1(8.76,37.01) v1(8.76,35.1) v1(8.99,88.23) v1(8.99,84.42) v1(10.6,54.03) v1(10.72,67.67) v1(11.3,37.01) v1(11.3,35.1) v1(11.3,33.2) v1(11.99,67.67) v1(12.04,42.7) v1(12.95,66.22) v1(13.27,37.01) v1(13.27,33.2) v1(15.09,57.96) v1(15.68,67.67) v1(15.85,50.32) v1(15.85,46.51) v1(16.76,85.9) v1(16.95,67.67) v1(17.34,85.33) v1(17.63,66.09) v1(18.9,66.09) v1(18.9,63.04) v1(18.9,60.5) v1(18.9,57.96) v1(18.9,54.15) v1(18.9,51.61) v1(18.9,49.07) v1(18.9,46.53) v1(20.64,94.22) v1(20.64,91.68) v1(21.46,37.01) v1(21.46,35.1) v1(21.46,33.2) v1(22.26,84.58) v1(22.26,83.41) v1(23.15,50.95) v1(23.15,45.87) v1(23.15,41.3) v1(23.46,84.56) v1(23.46,83.41) v1(25.58,91.15) v1(25.69,41.3) v1(28.23,41.3) v1(28.51,66.34) v1(28.61,50.95) v1(29.84,92.44) v1(30.77,41.3) v1(31.05,66.34) v1(31.15,50.95) v1(31.27,74.41) v1(32.32,76.63) v1(32.58,62.34) v1(32.89,86.7) v1(32.89,84.51) v1(33.11,74.41) v1(33.31,41.3) v1(33.59,66.34) v1(33.97,46.76) v1(34.16,37.01) v1(34.28,87.78) v1(34.28,85.59) v1(34.28,83.4) v1(35.12,62.34) v1(35.85,41.3) v1(36.13,66.34) v1(36.7,37.01) v1(37.4,76.63) v1(38.09,87.78) v1(38.09,83.4) v1(38.07,54.76) v1(38.61,49.14) v1(38.67,66.34) v1(39.24,37.01) v1(39.88,74.41) v1(41.21,69.52) v1(41.21,66.34) v1(42.54,81.14) v1(43.15,54.76) v1(43.15,50.95) v1(43.56,93.4) v1(43.75,69.52) v1(43.75,66.34) v1(45.21,46.6) v1(47.82,70.41) v1(49.52,91.59) v1(51.05,60.74) v1(51.05,58.2) v1(51.05,55.66) v1(51.63,75.49) v1(51.63,70.41) v1(52.2,47.36) v1(52.2,45.45) v1(53.33,91.59) v1(53.33,83.97) v1(55.5,79.68) v1(55.62,60.74) v1(55.62,58.19) v1(56.25,69.37) v1(57.14,83.97) v1(57.14,81.43) v1(57.14,75.34) v1(57.84,54.38) v1(60.95,87.78) v1(60.95,83.97) v1(60.95,81.05) v1(60.95,77.24) v1(60.95,61.56) v1(60.95,58.47) v1(62.85,91.59) v1(64.49,44.7) v1(64.76,87.78) v1(64.76,83.97) v1(64.76,81.05) v1(64.76,77.24) v1(65.02,58.47) v1(68.57,87.78) v1(68.57,83.97) v1(68.57,81.05) v1(68.57,77.24) v1(68.57,46.76) v1(72.38,65.81) v1(73.6,46.47) v1(74.1,42.72) v1(75.57,47.38) v1(75.56,43.8) v1(76.19,77.24) v1(76.19,65.81) v1(76.41,34.48) v1(76.41,33.21) v1(76.41,31.94) v1(76.41,30.67) v1(76.41,29.4) v1(76.41,28.13) v1(78.74,47.74) v1(79.12,59.22) v1(80,93.16) v1(80.9,34.53) v1(80.9,33.26) v1(80.9,31.99) v1(80.9,30.72) v1(80.9,29.45) v1(80.9,28.18) v1(80.9,26.91) v1(80.9,25.64) v1(81.6,65.33) v1(83.81,88.67) v1(83.81,84.86) v1(83.81,81.05) v1(83.81,77.24) v1(83.81,69.62) v1(83.81,63.08) v1(88.13,62) v1(88.13,58.19) v1(88.26,81.05) v1(88.26,77.24) v1(88.58,92.04) v1(88.58,88.67) v1(88.65,51.42) v1(90.14,43.42) v1(91.19,51.42) v1(92.27,33.26) v1(92.68,43.42) v1(93.73,51.42) v1(95.12,87.62) v1(95.12,85.08) v1(95.22,43.42) v1(96.01,66) v1(96.27,51.42) v1(97.41,58.19) v1(97.66,87.62) v1(97.66,85.08) v1(99.05,73.43) v1(99.05,69.62) v2(25.97,74.16) v2(27.74,67.49) v2(29.53,54.6) v2(30.6,62.34) v2(33.59,50.34) v2(33.97,44.31)
VCC_UNREG: length 98.1
  Top Layer w0.254: U3.3 v1(38.25,45.41)
  Top Layer w0.508: L4.2 38.25,57.07 34.81,57.07 C22.2 C23.2 29.29,56.96 29.26,56.94 ; C14.2 26.38,47.99 L3.1 32.31,47.99 ; 32.31,47.99 32.26,48.05 ; 32.31,47.99 32.33,47.98 32.46,48.11 v1(34.33,48.11) U3.6
  Top Layer w0.762: 46.48,58.22 45.78,57.52 45.7,57.52 ; 46.48,58.22 46.48,56.73 ; 46.48,58.22 46.48,78.84 ; 46.48,56.73 45.7,57.52 ; 46.48,56.73 46.48,54.22 45.47,53.2 v1(44.89,53.2) v1(44.04,53.2) 43.24,53.2 ; 45.7,57.52 43.46,57.52 C21.2 43.26,57.72 L4.2 ; 29.35,48.13 L3.1 ; v1(26.25,51.62) v1(26.25,50.79) v1(26.25,50.01) C14.2 ; 47.2,79.55 45.77,79.55 ; 47.2,79.55 v1(48.01,79.55) ; 47.2,79.55 46.48,78.84 ; 45.77,79.55 v1(43.04,79.55) ; 45.77,79.55 46.48,78.84
  Bottom Layer w0.254: v1(38.25,45.41) 35.55,48.11 v1(34.33,48.11)
  Bottom Layer w0.508: Q5.3 v1(48.01,79.55) ; 40.98,79.55 v1(43.04,79.55)
  Bottom Layer w0.762: v1(44.89,53.2) v1(44.04,53.2) v1(43.22,53.2) 27.83,53.2 v1(26.25,51.62) v1(26.25,50.79) v1(26.25,50.01)
#LOAD_EN_PRI: length 17.1
  Top Layer w0.254: v1(25.91,81.27) 24.38,81.27 23.86,81.79 U1.10
  Bottom Layer w0.254: v1(25.91,81.27) 25.97,81.33 29.65,81.33 32.38,78.6 Q3.1
  Bottom Layer w0.508: Q6.1 37.66,78.6 37.34,78.28 35.62,78.28 35.3,78.6 Q3.1
#LOAD_EN_SEC: length 45.1
  Top Layer w0.254: U1.9 23.36,81.59 24.27,80.68 v1(26.42,80.68)
  Top Layer w0.508: v1(48.17,86.41) 49.34,85.24 49.34,78.58 v1(48.15,77.39)
  Bottom Layer w0.254: 43.99,78.6 42.42,78.6 41.21,77.39 32.83,77.39 29.54,80.68 v1(26.42,80.68)
  Bottom Layer w0.508: Q1.1 47.11,86.09 47.43,86.41 v1(48.17,86.41) 49.15,86.41 49.47,86.09 Q4.1 ; Q5.1 45.34,78.6 45.66,78.28 47.37,78.28 47.69,78.6 Q2.1 48.79,78.03 v1(48.15,77.39)
#LORA_RES: length 13.1
  Top Layer w0.254: U12.6 74.09,83.16 72.77,81.84 U11.21
+VGG: length 58.6
  Top Layer w1.27: D2.1 30.92,20.53 31.38,20.99 45.4,20.99 45.42,21 45.41,21.02 ; R26.2 49.17,17.32 45.55,20.94 R23.2
AUX_BATT+: length 55.2
  Top Layer w0.254: v1(26.03,84.72) 25.82,84.5 U1.14
  Top Layer w0.508: 27.5,87.98 27.5,88.04 27.52,88.06 ; 27.5,87.98 v1(27.5,86.16) ; 27.5,87.98 27.39,88.09 27.39,90.47 ; 27.5,87.98 C1.2 ; v1(22.86,75.36) 15.18,75.36 12.7,77.84 12.7,83.74 10.67,85.78 6.67,85.78
  Bottom Layer w0.508: 26.03,82.66 26.42,83.05 ; 26.03,82.66 26.03,83.43 ; 26.03,82.66 22.86,79.49 v1(22.86,75.36) ; 26.42,83.05 29.21,83.05 32.7,79.55 Q3.3 ; 26.42,83.05 26.03,83.43 ; 26.03,83.43 v1(26.03,84.72) 27.47,86.16 v1(27.5,86.16)
CS: length 33.1
  Top Layer w0.254: U11.18 v1(65.15,70.09) ; U12.5 v1(79.12,85.16)
  Bottom Layer w0.254: v1(65.15,70.09) 76.64,70.09 79.12,72.57 v1(79.12,85.16)
GEIG_PULSE: length 65.5
  Top Layer w0.254: R27.1 89.13,36.28 90.04,37.2 98.36,37.2 99.38,38.21 99.38,65.39 97.16,67.61 88.77,67.61 85.47,70.92 U11.26 ; Q15.3 85.13,32.05 85.6,32.51 88.96,32.51 D7.1 89.15,32.35 89.15,34.8
HV_DIR: length 78.6
  Top Layer w0.508: R29.2 67.69,44.69 66.17,43.17 v1(47.69,43.17)
  Bottom Layer w0.508: CN4.2 10.16,59.42 12.83,56.76 12.83,47.23 16.89,43.17 v1(47.69,43.17)
HV_SPD: length 73.3
  Top Layer w0.508: R32.2 72.77,44.69 70.42,42.34 v1(47.69,42.34)
  Bottom Layer w0.508: v1(47.69,42.34) 16.51,42.34 12.64,46.22 CN5.2
I2C_SCL: length 29.9
  Top Layer w0.254: U11.9 v1(80.39,59.22) 80.39,63.04 82.87,65.52 v1(94.28,65.52)
  Bottom Layer w0.254: R35.1 NOREF#4.31 v1(80.39,59.22) ; U9.6 94.72,65.96 v1(94.28,65.52) 94.28,64.38 94.29,64.37
I2C_SDA: length 30.5
  Top Layer w0.254: U11.8 v1(77.85,59.22) 77.85,63.8 80.21,66.17 v1(91.63,66.17)
  Bottom Layer w0.254: v1(77.85,59.22) R34.1 ; 91.69,67.58 91.63,67.51 v1(91.63,66.17) 91.99,65.81 91.99,64.37
MIC_OUT: length 7.4
  Top Layer w0.508: v1(75.31,52.44) U11.7
  Bottom Layer w0.508: U7.2 U7.1 76.23,50.44 75.31,51.36 v1(75.31,52.44)
MISO: length 52
  Top Layer w0.254: v1(81.34,91.17) 76.34,91.17 U12.2 ; U11.16 v1(60.07,68.03)
  Bottom Layer w0.254: v1(60.07,68.03) 60.11,68 77.41,68 81.34,71.93 v1(81.34,91.17)
MOSI: length 44.8
  Top Layer w0.254: U12.3 76.34,89.14 v1(80.58,89.14) ; U11.17 v1(62.61,68.69)
  Bottom Layer w0.254: v1(62.61,68.69) 77.15,68.69 80.58,72.12 v1(80.58,89.14)
MPPT_VBAT_OK: length 65.3
  Top Layer w0.254: U11.20 70.23,69.71 67.06,66.54 54.8,66.54 52.58,68.76 v1(52.58,82.09) ; v1(26.75,84.09) 26.66,84 U1.13
  Bottom Layer w0.254: v1(26.75,84.09) 31.28,84.09 33.27,82.09 v1(52.58,82.09)
PANEL+: length 26.8
  Top Layer w0.254: v1(19.18,85.08) 19.75,84.5 U1.2
  Top Layer w0.508: D1.1 11.81,93.06 ; 11.81,93.06 11.28,93.59 ; 11.81,93.06 12.34,93.59
  Top Layer w0.762: 6.67,92.82 9.08,92.82 9.84,93.59 15.47,93.59 L1.1 v1(15.47,87.89) 15.47,86.39 C7.2
  Bottom Layer w0.508: v1(15.47,87.89) 16.36,87.89 v1(19.18,85.08)
SCK: length 54.7
  Top Layer w0.254: U12.4 76.33,87.15 v1(79.84,87.15) ; U11.1 60.07,57.26 v1(58.86,58.47)
  Bottom Layer w0.254: v1(58.86,58.47) 58.86,68.25 60.01,69.39 76.9,69.39 79.84,72.34 v1(79.84,87.15)
SERVO_CTRL: length 74.7
  Top Layer w0.254: v1(56.26,63.11) 66.36,63.11 67.69,61.77 U11.4
  Bottom Layer w0.254: CN3.2 6.74,72.52 8.05,72.52 9.65,70.92 9.65,66.6 12.06,64.19 55.18,64.19 v1(56.26,63.11)
SERVO_EN: length 68
  Top Layer w0.254: U11.19 67.69,68.12 66.76,67.2 v1(56.26,67.2)
  Bottom Layer w0.254: v1(56.26,67.2) 56.26,65.9 55.18,64.82 16.26,64.82 13.04,68.04 13.04,70.26 R18.1 13.04,70.65 Q8.1
SERVO_GND: length 22.6
  Top Layer w0.508: v1(9.65,72.89) 11.6,72.89
  Top Layer w0.762: C4.1 11.68,72.59 11.68,73.71 10.29,75.11 CN3.3
  Bottom Layer w0.508: 9.17,75.11 9.17,74.72 ; 9.17,75.11 9.56,75.11 ; 9.17,75.11 8.78,75.11 ; 9.17,74.72 8.78,75.11 ; 9.17,74.72 9.56,75.11 ; 9.17,74.72 9.17,73.37 v1(9.65,72.89) ; 8.78,75.11 CN3.3 6.95,75.36 8.55,75.36 ; 8.78,75.11 8.55,75.33 8.55,75.36 ; 8.55,75.36 10.92,75.36 11.18,75.11 ; Q8.3 11.18,75.11 ; 11.18,75.11 9.56,75.11
UART_RX: length 41.9
  Top Layer w0.254: v1(85.47,57.9) U11.11
  Bottom Layer w0.254: 66.94,41.07 66.94,48.87 65.72,50.09 65.72,56.5 67.12,57.9 v1(85.47,57.9)
  Bottom Layer w0.508: R31.1 66.94,41.07
UART_TX: length 31.4
  Top Layer w0.254: v1(82.93,58.48) U11.10
  Bottom Layer w0.254: v1(82.93,58.48) 67,58.48 65.21,56.69 65.21,47.25 65.19,47.23
WIND_DIR: length 6.7
  Top Layer w0.508: 67.69,50.88 70.23,50.88 U11.5
WIND_SPD: length 6.7
  Top Layer w0.508: U11.6 72.77,50.88 75.31,50.88
$2N5941: length 10.6
  Top Layer w0.254: v1(19.18,79.3) 19.17,79.29 R2.2 R4.1 ; U1.3 19.42,84 v1(19.18,84.25)
  Bottom Layer w0.254: v1(19.18,79.3) v1(19.18,84.25)
$2N7577: length 3.1
  Top Layer w0.762: L1.2 18.57,88.63
$2N7629: length 68.9
  Top Layer w0.254: v1(16.7,76.32) 16.31,76.32 15.68,76.95 R4.2 ; U1.19 22.36,86.72 ; 22.36,86.72 v1(22.29,86.79) 22.29,88.32 22.35,88.38 22.36,88.37 22.36,86.72
  Top Layer w0.508: 22.35,88.38 22.35,93.14 C11.2 v1(23.94,93.33)
  Bottom Layer w0.254: v1(22.29,86.79) 20.45,84.95 20.45,78.47 18.3,76.32 v1(16.7,76.32)
  Bottom Layer w0.508: Q2.3 52.26,79.55 54.04,81.33 54.04,87.05 52.32,88.76 44.7,88.76 40.13,93.33 23.94,93.33 v1(23.94,93.33)
$2N8110: length 5
  Bottom Layer w0.508: Q5.2 45.34,80.5 45.66,80.82 47.37,80.82 47.69,80.5 Q2.2
$2N8222: length 5
  Bottom Layer w0.508: Q6.2 37.66,80.5 37.34,80.82 35.62,80.82 35.3,80.5 Q3.2
$2N8591: length 6.2
  Top Layer w0.508: L2.2 32.11,72 26.35,72 U2.1
$2N9223: length 4.6
  Top Layer w0.254: R10.2 R9.1
  Top Layer w0.508: U2.4 24.46,69.03 R10.2
$2N9777: length 4.8
  Top Layer w0.508: R11.1 R12.2 37.29,50.82 U3.4
$2N9787: length 6
  Top Layer w0.508: U3.1 29.73,45.41 29.49,45.66
$2N10317: length 7.8
  Top Layer w0.254: 23.91,78.03 24.15,77.78 ; 23.91,78.03 23.91,77.78 ; 23.91,78.03 23.91,80.34 22.86,81.39 U1.8 ; 23.91,78.03 23.67,77.78 ; 24.15,77.78 24.96,77.78 R5.2 ; 24.15,77.78 23.91,77.78 ; 23.91,77.78 23.67,77.78 ; R3.1 23.67,77.78
$2N10326: length 5.4
  Top Layer w0.254: U1.7 22.36,81.13 22.86,80.63 22.86,79.3 R3.2 R1.1
$2N10596: length 7.7
  Top Layer w0.254: R5.1 R6.2 27.09,81.93 26.01,83 U1.11
$2N10600: length 11.5
  Top Layer w0.254: 28.14,77.8 28.42,77.8 ; 28.14,77.8 27.86,77.8 ; 28.14,77.8 28.14,78.08 ; 28.42,77.8 28.14,78.08 ; 28.42,77.8 R7.1 ; R6.1 27.86,77.8 ; 27.86,77.8 28.14,78.08 ; 28.14,78.08 28.14,82.34 26.97,83.5 U1.12
$2N12892: length 3.7
  Top Layer w0.254: C8.1 17.85,83.84 18.51,83.84 18.84,83.5 U1.4
$2N20792: length 42.8
  Top Layer w0.254: U2.3 v1(24.45,73.08)
  Top Layer w0.508: U2.6 v1(27.74,69.04) 29.31,69.04 C15.2 32.26,69.15
  Top Layer w0.762: L2.1 35.27,69.51 C13.2 ; 35.32,69.38 C13.2 ; C13.2 38.46,69.38 41.34,72.25 41.34,82.47 44.01,85.14 v1(47.37,85.14)
  Bottom Layer w0.254: v1(27.74,69.04) 25.82,69.04 24.45,70.41 24.45,73.07 v1(24.45,73.08)
  Bottom Layer w0.508: 48.56,85.14 v1(47.37,85.14)
$2N21137: length 5
  Bottom Layer w0.508: Q1.2 47.11,84.19 47.43,83.87 49.15,83.87 49.47,84.19 Q4.2
$2N24413: length 4.1
  Bottom Layer w0.508: F1.2 Q1.3
$2N24422: length 50.8
  Top Layer w0.254: U1.18 22.86,86.41 v1(23.24,86.79) v1(24.26,86.79)
  Top Layer w1.524: 59.04,91.37 56.43,88.76 40.84,88.76 SC1.1
  Bottom Layer w0.762: 35.63,90.67 35.63,89.26 36.78,88.11 F1.1 ; 35.63,90.67 34.93,91.37 ; 35.63,90.67 36.33,91.37 ; 35.63,90.67 35.63,91.37 ; v1(23.24,86.79) v1(24.26,86.79) 28.84,91.37 34.93,91.37 ; 36.33,91.37 SC1.1 ; 36.33,91.37 35.63,91.37 ; 34.93,91.37 35.63,91.37
$2N29897: length 2.1
  Top Layer w0.254: R8.1 29.21,79.32 R7.2
$3N6805: length 19.6
  Top Layer w0.762: 22.52,27.16 24.61,29.25 Q13.2 Q13.2 ; 35.07,29.9 33.88,29.9 Q13.2 ; 35.07,29.9 34.42,30.55 ; 35.07,29.9 35.88,29.9 37.16,31.18 38.07,31.18 ; 35.07,29.9 34.42,29.24 ; Q13.2 33.88,29.06
$3N7230: length 11.6
  Top Layer w0.508: U5.6 v1(69.09,29.97) 69.09,28.08 69.06,28.06 ; U5.3 v1(73.28,33.27)
  Bottom Layer w0.508: v1(73.28,33.27) 73.28,31.1 72.15,29.97 v1(69.09,29.97)
$3N8225: length 3.5
  Top Layer w0.762: D5.2 D6.1
$3N8233: length 4.5
  Top Layer w0.762: D4.2 D5.1
$3N8237: length 3.5
  Top Layer w0.762: D3.2 D4.1
$3N8334: length 19.5
  Top Layer w1.27: 18.62,20.53 17.77,19.68 ; 18.62,20.53 D2.2 ; 18.62,20.53 17.77,21.38 ; 17.77,19.68 17.77,21.38 ; 17.77,19.68 17.77,19.45 ; 17.77,21.38 17.77,24.12 14.74,27.16 12.02,27.16
$3N8590: length 10.6
  Top Layer w0.508: Q14.3 67.22,27.45 68.14,26.53 69.04,26.53 R22.1 71.76,26.55 C29.2 71.89,31.27 U5.1
$3N8761: length 7.2
  Top Layer w1.27: R23.1 R24.3
$3N8975: length 9.8
  Top Layer w0.508: R24.2 57.84,30.73 60.51,28.06 C30.2 63.06,28.06 63.4,28.4 Q14.1
$3N11491: length 3.3
  Top Layer w0.508: C34.1 84.18,26.36 Q15.1
$3N12768: length 5.8
  Top Layer w0.508: 55.92,33.27 R25.2
$3N22643: length 26.6
  Top Layer w0.762: R26.1 95.83,25.72 95.58,25.97
  Top Layer w1.27: CN6.1 CN6.1 95.8,17.26 95.86,17.32
$3N22647: length 4.6
  Top Layer w0.762: C33.1 C34.2
$3N24445: length 6
  Top Layer w0.508: Q13.1 27.94,34.84 R20.1 27.94,34.86 R19.1
$3N24449: length 39
  Top Layer w0.508: U5.4 69.15,33.34 v1(69.15,34.85) ; R19.2 32.14,34.85 v1(33.91,34.85)
  Bottom Layer w0.508: v1(33.91,34.85) 53.59,34.85 53.97,35.23 57.78,35.23 58.17,34.85 v1(69.15,34.85)
$4N2106: length 13.9
  Top Layer w0.508: U6.1 v1(85.09,47.25)
  Bottom Layer w0.508: v1(85.09,47.25) R28.1 81.26,47.25 79.95,48.56 79.95,50.42 U7.3
$4N5820: length 2.8
  Bottom Layer w0.254: U10.4 C37.2
$4N12930: length 6.2
  Bottom Layer w0.508: U8.2 62.68,47.22 R31.2
$5N3100: length 7.1
  Top Layer w0.254: R13.1 26.66,61.67 R14.2 26.65,61.64 26.65,60.88 27.36,60.17 27.36,59.23
$5N3103: length 10.8
  Top Layer w0.508: L4.1 38.9,60.82 30.01,60.82 29.26,60.07 29.26,59.23
$5N10764: length 5.1
  Bottom Layer w0.508: 55.64,71.72 54.71,71.72 54.51,71.92 R16.2 52.67,71.92 51.92,72.67 Q7.3
$5N11729: length 5.1
  Bottom Layer w0.508: Q12.3 40.26,72.69 41.01,71.94 R17.2 42.98,71.94 43.18,71.74 Q11.1
$6N1191: length 5.6
  Top Layer w0.508: U12.9 ANT1.1

## Copper pours and planes (outline as drawn; the poured copper is in the pictures)
GND on Top Layer: 73.91,45.07 67.63,38.79 0,38.79 0,66.69 14.26,66.69 17.14,63.8 17.14,44.95 21.97,40.12 49.53,40.12 54.18,44.77 54.18,76.01 60.14,81.97 70.29,81.97 72.58,84.25 72.58,94.98 100,94.98 100,83.74 95.05,83.74 92.4,81.09 92.4,77.26 95.06,74.6 100,74.6 100,57.08 76.13,57.08 73.91,54.86
GND on Top Layer: 13.02,78.73 10.22,78.73 8.45,80.51 0,80.51 0,94.98 71.63,94.98 71.95,94.67 71.95,84.38 70.03,82.46 59.89,82.46 53.67,76.25 32.01,76.25 31.12,77.14 31.12,83.36 29.65,84.82 19.11,84.82 18.51,84.22 18.51,82.25 17.91,81.65 13.53,81.65 13.02,81.14
GND on Top Layer: 7.75,26.59 10.16,24.18 13.97,24.18 15.24,22.91 15.24,16.12 0,16.12 0,37.77 78.18,37.77 78.18,21.89 59.69,21.89 59.69,34.02 58.23,35.48 53.21,35.48 51.82,34.09 25.72,34.09 23.05,31.42 9.97,31.42 7.75,29.2
GND on Top Layer: 74.42,54.66 76.33,56.57 100,56.57 100,38.79 66.17,38.79 67.53,40.15 69.62,40.15 74.42,44.95
GND on Top Layer: 22.1,40.69 17.65,45.14 17.65,64 14.48,67.17 0,67.17 0,79.99 8.19,79.99 13.97,74.22 23.05,74.22 24.57,75.74 53.51,75.74 53.51,44.86 49.34,40.69
GND on Top Layer: 82.99,28.44 99.99,28.44 100,28.43 100,37.77 79.44,37.77 79.44,21.91 92.76,21.91 92.76,23.48 82.99,23.48 81.98,24.5 81.98,27.42
GND on Bottom Layer: 0,37.77 100,37.77 100,16.12 0,16.12
GND on Bottom Layer: 22.1,40.69 17.65,45.14 17.65,64 14.48,67.17 0,67.17 0,79.99 8.19,79.99 13.97,74.22 23.05,74.22 24.57,75.74 53.45,75.74 53.45,44.8 49.34,40.69
GND on Bottom Layer: 0,94.98 71.97,94.98 71.97,84.41 70.03,82.46 59.89,82.46 53.68,76.25 24.38,76.25 22.86,74.73 14.22,74.73 8.44,80.51 0,80.51
GND on Bottom Layer: 74.42,54.66 76.33,56.57 100,56.57 100,38.79 67.56,38.79 68.86,40.08 69.56,40.08 74.42,44.95
GND on Bottom Layer: 73.91,45.07 67.63,38.79 2.29,38.79 2.29,66.69 14.26,66.69 17.14,63.8 17.14,44.95 21.97,40.12 49.53,40.12 54.18,44.77 54.18,76.01 60.14,81.97 70.29,81.97 72.58,84.25 72.58,94.98 100,94.98 100,83.74 95.05,83.74 92.38,81.08 92.38,77.28 95.06,74.6 100,74.6 100,57.08 76.13,57.08 73.91,54.86
$2N7577 on Top Layer: 20.75,86.43 19.49,87.68 19.49,94.03 17.59,94.03 17.59,87.24 19.37,85.46 22,85.46 22,86.19 21.76,86.43

## Text on the board
Bottom Silkscreen Layer: DESIGNED BY: / GIORGIO SCACCHIERO / CRISTIAN PICCONE / GIACOMO PASCON | 3V3 | GND | SDA | SCL | JLCJLCJLCJLC | AUX I2C | REV. 0 - 15/08/25
Top Silkscreen Layer: PN- | AB- | GND | CTL | DIR | AGN | SPD | PN+ | AB+ | 5V | 25V | HIGH | VOLTAGE | SIDE | + | -
